# EAGLE design BH1750 V1.0 (EAGLE 6.1)
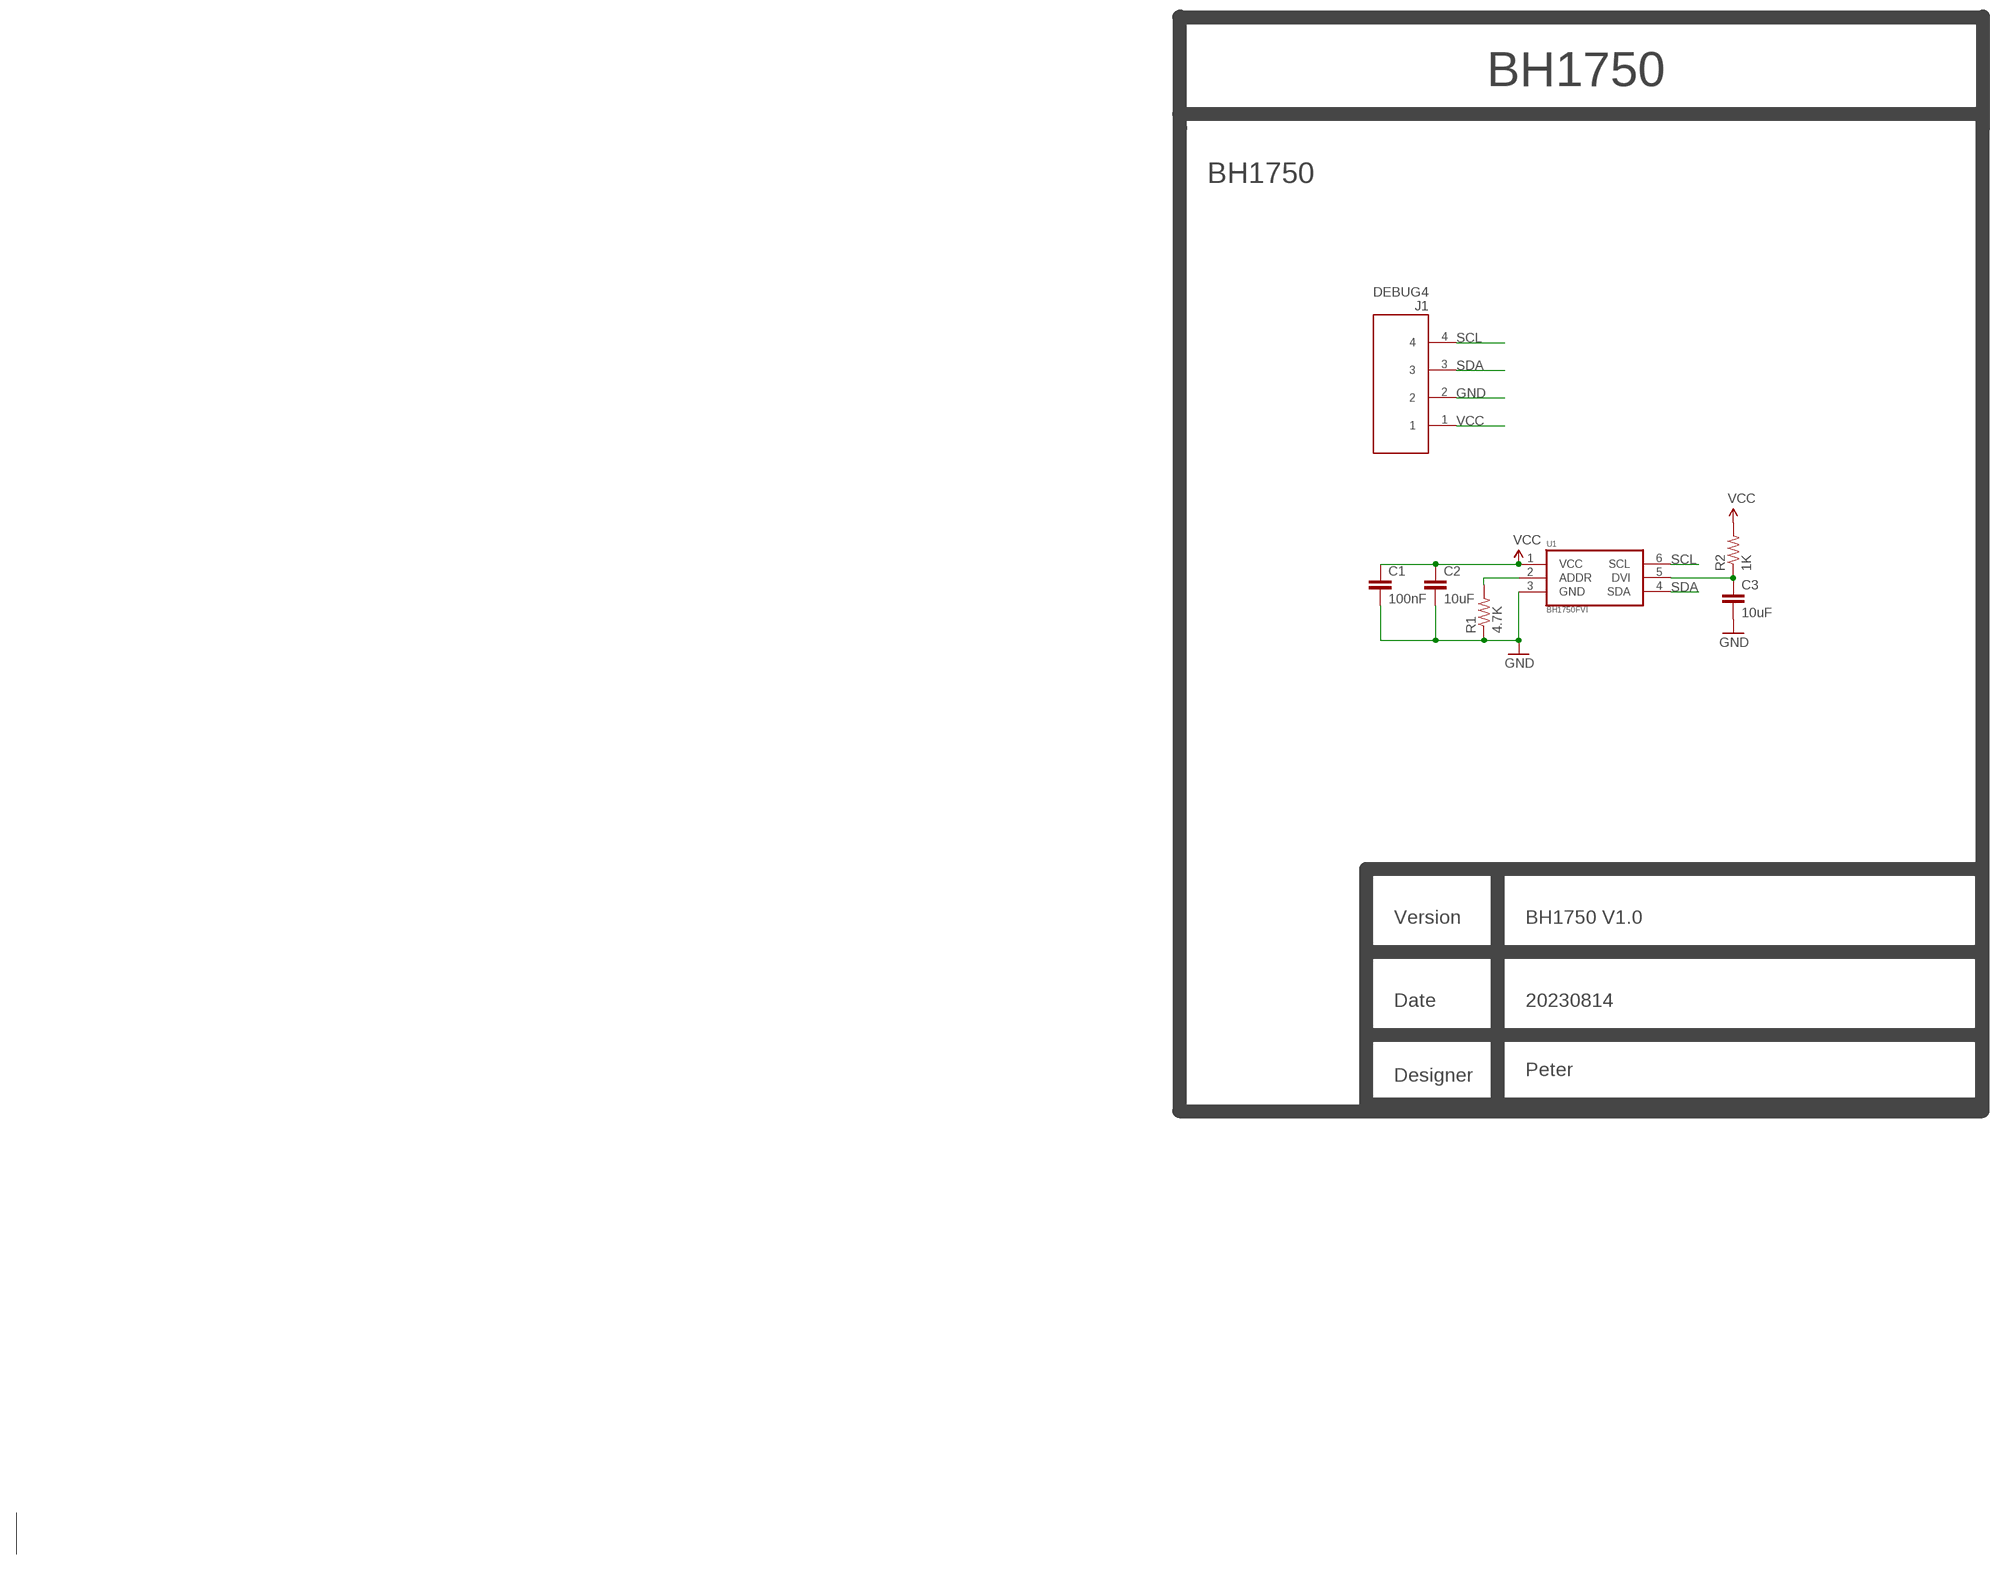
[diagram p0: schematic, sheet 1]

## Parts
C1  100nF  C0603  [C0603]
C2  10uF  C0603  [C0603]
C3  10uF  C0603  [C0603]
J1  DEBUG4  [DEBUG*4]
R1  4.7K  R0603  [R0603]
R2  1K  R0603  [R0603]
U1  BH1750FVI  [WSOF6I]

## Nets
GND: C1.2 C2.2 C3.2 J1.2 R1.1 U1.3(GND)
N$2: C3.1 R2.1 U1.5(DVI)
N$3: R1.2 U1.2(ADDR)
SCL: J1.4 U1.6(SCL)
SDA: J1.3 U1.4(SDA)
VCC: C1.1 C2.1 J1.1 R2.2 U1.1(VCC)

## Notes on the sheet
- BH1750
- BH1750
- Version | BH1750 V1.0
- Date | 20230814
- Peter
- Designer

## Library data of the parts
C1-C3 = Makerfabs-Peter:C0603
J1 = Makerfabs-Peter:DEBUG*4
R1 R2 = Makerfabs-Peter:R0603
U1 = Makerfabs-Peter:BH1750FVI

## Net classes
0 default: width 0.152 mm, drill 0.254 mm, clearance 0.152 mm

## Board
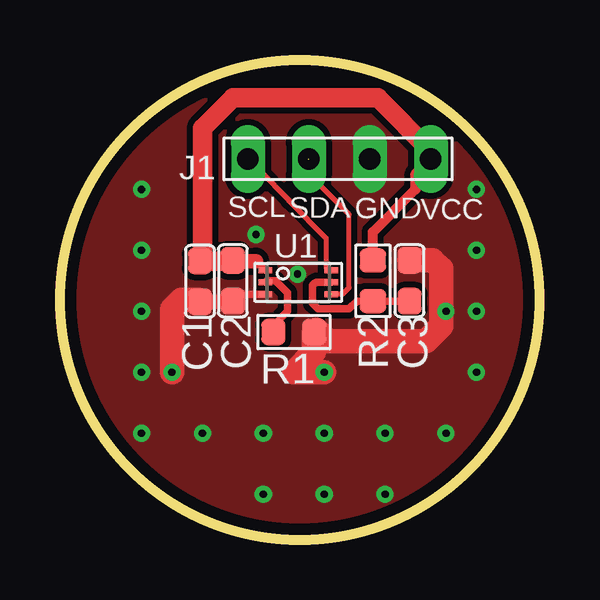
[diagram p1: board, top side]
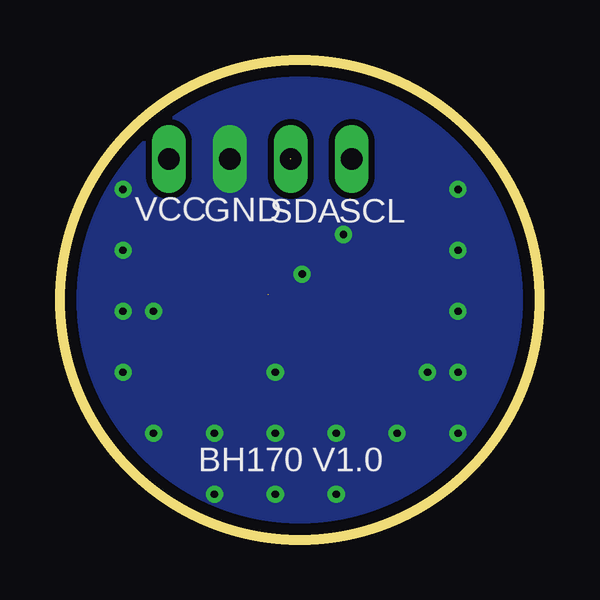
[diagram p2: board, bottom side, seen from below]

Size 20 x 20 mm. Coordinates in mm from the lower left corner, seen from the top.
Outline: circle at 10,10 radius 10
Copper layers (1*16): Top 0.035mm / dielectric 1.5mm / Bottom 0.035mm
Design rules: minimum track width 8mil, minimum drill 12mil, track to track 8mil, track to pad 8mil, pad to pad 8mil, via to via 8mil, smd to smd 0mil, copper to edge 20mil, drill to drill 8mil, minimum pad ring 10mil, minimum via ring 8mil, stop-mask expansion 2mil, vias tented up to drill 30mil, thermal gap 0mil

### Footprints (pad centres in the part's own frame; a part is rotated, then mirrored left to right if it is on the bottom)
C0603 = smd 1.1 x 1: 1 -0.85,0; 2 0.85,0
DEBUG*4 = drill 0.9 long: 1 0,0; 2 0,-2.54; 3 0,-5.08; 4 0,-7.62
R0603 = smd 1 x 1.1: 1 -0.85,0; 2 0.85,0
WSOF6I = smd 0.55 x 0.25: 1 -1.187,0.436; 2 -1.187,-0.064; 3 -1.187,-0.564; 4 1.563,-0.564; 5 1.563,-0.064; 6 1.563,0.436

### Placement (x,y rotation side)
C1  5.84,10.77 270 top
C2  7.21,10.8 270 top
C3  14.58,10.8 90 top
J1  15.46,15.88 270 top
R1  9.75,8.67 180 top
R2  13.05,10.8 90 top
U1  9.75,10.8 0 top

### Tracks (layer width: path | path; a pad name or v marks a point on that pad's centre or on a via)
GND  (via drill 0.3)
  Top 0.305: U1.3 7.5,10.24 C2.2
  Top 0.61: C1.2 7.19,9.93 C2.2
  Top 1.016: v11.02,6.99 9.75,6.99 10.6,7.84 R1.1 10.69,8.77 11.17,8.29 15.26,8.29 15.9,8.92 15.9,11.31 15.54,11.66 14.59,11.66 C3.2 | v4.67,6.99 4.67,9.61 5.08,10.01 5.75,10.01 C1.2
  other vias: 13.56,4.45 16.1,9.53 11.02,4.45 8.48,4.45 5.94,4.45 3.4,4.45 3.4,6.99 3.4,9.53 3.4,12.07 16.1,4.45 17.37,6.99 17.37,9.53 17.37,12.07 17.37,14.61 3.4,14.61 8.18,12.73 9.9,11.08 8.48,1.91 11.02,1.91 13.56,1.91
  pour Top (isolate 0.254, rank 6): -1.68,20.96 -1.68,-0.63 21.18,-0.63 21.18,4.45 21.18,20.96
  pour Bottom (isolate 0.254, rank 6): -4.22,23.5 -5.49,23.5 -5.49,-3.17 23.72,-3.17 23.72,23.5
N$2
  Top 0.305: C3.1 R2.1 12.38,9.95 12.06,9.63 10.77,9.63 10.54,9.86 10.54,10.62 10.61,10.7 10.64,10.7 10.69,10.75 U1.5
N$3
  Top 0.305: R1.2 8.9,8.93 9.5,9.53 9.5,10.29 8.99,10.8 8.63,10.8 U1.2
SCL
  Top 0.203: U1.6 11.28,11.21 11.22,11.21 11.1,11.33 11.1,12.58 9.55,14.13 9.55,14.15 8.96,14.74 8.96,14.76 J1.4
SDA  (2 unrouted)
  Top 0.203: 11.3,10.24 11.78,10.24 12.06,10.52 12.06,13.57 10.26,15.37 10.26,15.75 10.36,15.86
VCC
  Top 0.203: 6.39,11.62 C1.1 5.84,11.97 5.94,12.07 | J1.1 15.49,15.88 15.52,15.86
  Top 0.305: 8.17,11.62 U1.1 | C2.1 7.21,11.62
  Top 0.406: R2.2 13.05,12.83 14.83,14.61 14.83,15.25 J1.1
  Top 0.61: 7.21,11.62 8.17,11.62
  Top 0.813: 7.21,11.62 6.39,11.62 | 15.49,15.83 15.52,15.86 15.52,16.16 13.26,18.42 7.21,18.42 5.94,17.15 5.94,12.07

### Text on the board
tPlace: SCL | SDA | GND | VCC
bPlace: SCL | SDA | GND | VCC | BH170 V1.0